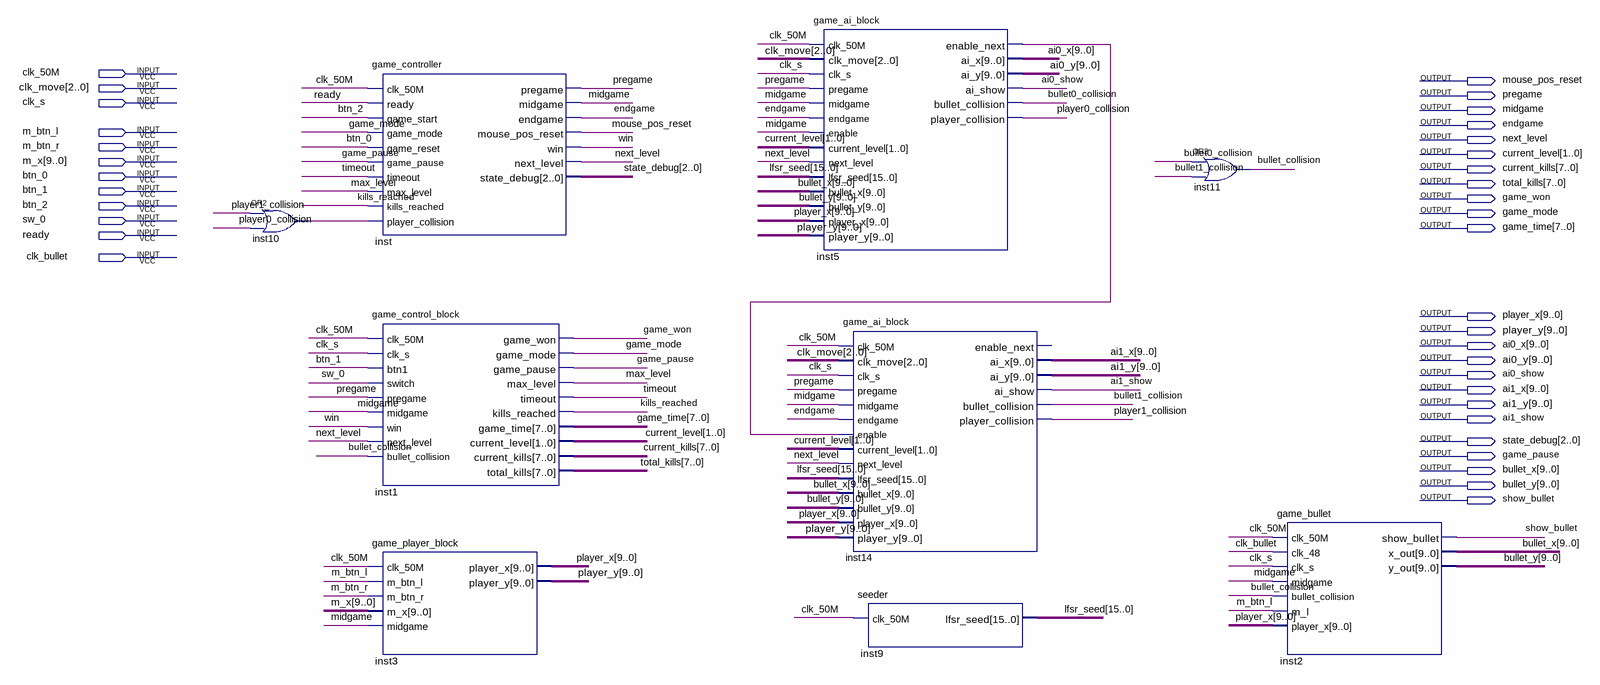
[diagram p0: schematic sheet]
// Quartus schematic game.bdf as structural Verilog: 9 symbols, 36 pins
module game (
  input  clk_50M,
  input  [2:0] clk_move,
  input  clk_s,
  input  m_btn_l,
  input  m_btn_r,
  input  [9:0] m_x,
  input  btn_0,
  input  btn_1,
  input  btn_2,
  input  sw_0,
  input  ready,
  input  clk_bullet,
  output mouse_pos_reset,
  output pregame,
  output midgame,
  output endgame,
  output next_level,
  output [1:0] current_level,
  output [7:0] current_kills,
  output [7:0] total_kills,
  output game_won,
  output game_mode,
  output [7:0] game_time,
  output [9:0] player_x,
  output [9:0] player_y,
  output [9:0] ai0_x,
  output [9:0] ai0_y,
  output ai0_show,
  output [9:0] ai1_x,
  output [9:0] ai1_y,
  output ai1_show,
  output [2:0] state_debug,
  output game_pause,
  output [9:0] bullet_x,
  output [9:0] bullet_y,
  output show_bullet
);

  wire bullet0_collision, bullet1_collision, bullet_collision, inst5_enable_next, inst10_out, kills_reached,
       max_level, player0_collision, player1_collision, timeout, win;
  wire [15:0] lfsr_seed;

  or inst10 (inst10_out, player1_collision, player0_collision);
  game_controller inst (
    .clk_50M(clk_50M), .ready(ready), .game_start(btn_2), .game_mode(game_mode), .game_reset(btn_0),
    .game_pause(game_pause), .timeout(timeout), .max_level(max_level), .kills_reached(kills_reached),
    .player_collision(inst10_out), .pregame(pregame), .midgame(midgame), .endgame(endgame),
    .mouse_pos_reset(mouse_pos_reset), .win(win), .next_level(next_level), .state_debug(state_debug));
  game_control_block inst1 (
    .clk_50M(clk_50M), .clk_s(clk_s), .btn1(btn_1), .switch(sw_0), .pregame(pregame), .midgame(midgame),
    .win(win), .next_level(next_level), .bullet_collision(bullet_collision), .game_won(game_won),
    .game_mode(game_mode), .game_pause(game_pause), .max_level(max_level), .timeout(timeout),
    .kills_reached(kills_reached), .game_time(game_time), .current_level(current_level),
    .current_kills(current_kills), .total_kills(total_kills));
  game_player_block inst3 (
    .clk_50M(clk_50M), .m_btn_l(m_btn_l), .m_btn_r(m_btn_r), .m_x(m_x), .midgame(midgame),
    .player_x(player_x), .player_y(player_y));
  game_ai_block inst5 (
    .clk_50M(clk_50M), .clk_move(clk_move), .clk_s(clk_s), .pregame(pregame), .midgame(midgame),
    .endgame(endgame), .enable(midgame), .current_level(current_level), .next_level(next_level),
    .lfsr_seed(lfsr_seed), .bullet_x(bullet_x), .bullet_y(bullet_y), .player_x(player_x),
    .player_y(player_y), .enable_next(inst5_enable_next), .ai_x(ai0_x), .ai_y(ai0_y), .ai_show(ai0_show),
    .bullet_collision(bullet0_collision), .player_collision(player0_collision));
  game_ai_block inst14 (
    .clk_50M(clk_50M), .clk_move(clk_move), .clk_s(clk_s), .pregame(pregame), .midgame(midgame),
    .endgame(endgame), .enable(inst5_enable_next), .current_level(current_level), .next_level(next_level),
    .lfsr_seed(lfsr_seed), .bullet_x(bullet_x), .bullet_y(bullet_y), .player_x(player_x),
    .player_y(player_y), .ai_x(ai1_x), .ai_y(ai1_y), .ai_show(ai1_show),
    .bullet_collision(bullet1_collision), .player_collision(player1_collision));  // open: enable_next
  seeder inst9 (.clk_50M(clk_50M), .lfsr_seed(lfsr_seed));
  or inst11 (bullet_collision, bullet0_collision, bullet1_collision);
  game_bullet inst2 (
    .clk_50M(clk_50M), .clk_48(clk_bullet), .clk_s(clk_s), .midgame(midgame),
    .bullet_collision(bullet_collision), .m_l(m_btn_l), .player_x(player_x), .show_bullet(show_bullet),
    .x_out(bullet_x), .y_out(bullet_y));
endmodule
